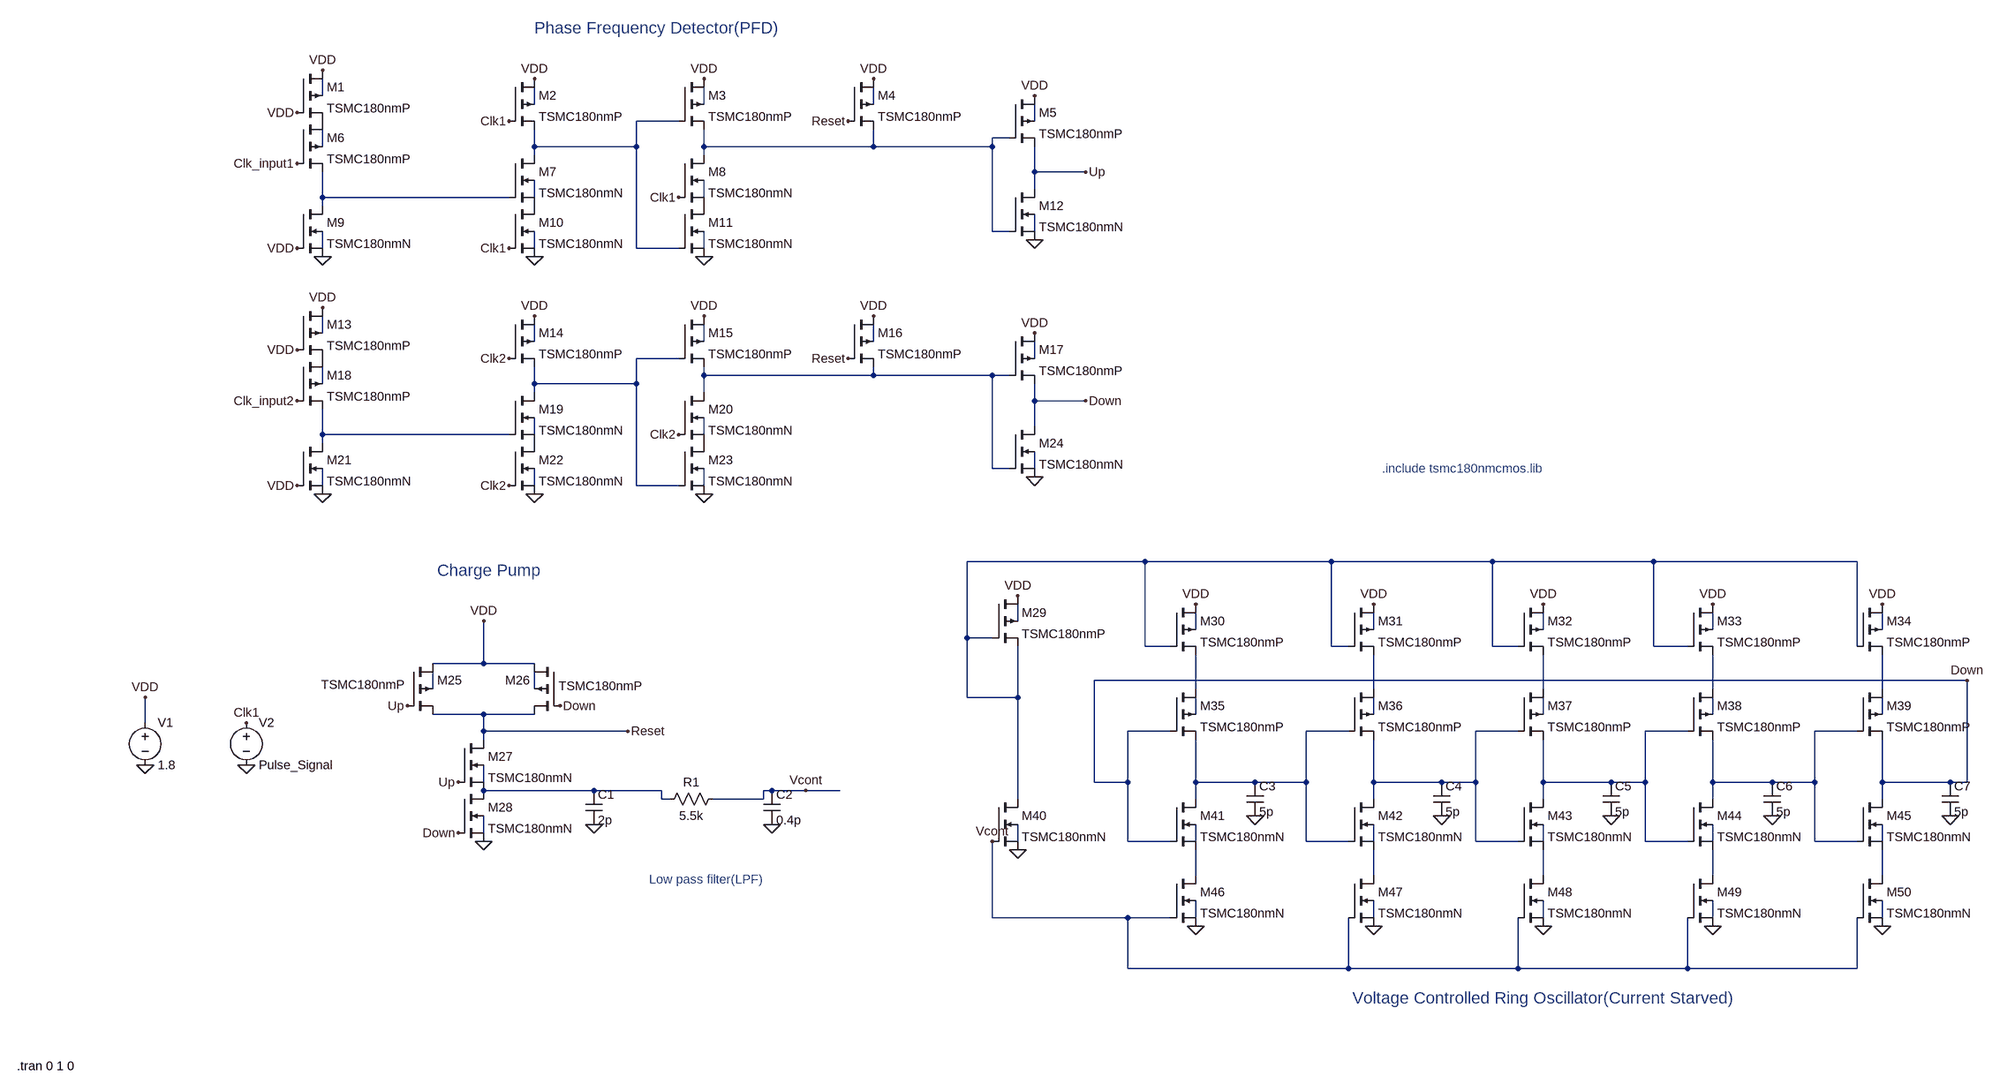
[diagram p0: schematic Pll.asc]
Pll.asc, the LTspice schematic file:
Version 4
SHEET 1 5760 2408
WIRE 1120 -464 1120 -496
WIRE 1520 -448 1520 -480
WIRE 1840 -448 1840 -480
WIRE 2160 -448 2160 -480
WIRE 1792 -416 1712 -416
WIRE 2464 -416 2464 -448
WIRE 2416 -384 2384 -384
WIRE 1120 -368 1120 -400
WIRE 1520 -368 1520 -400
WIRE 1712 -368 1712 -416
WIRE 1712 -368 1520 -368
WIRE 1840 -368 1840 -400
WIRE 2160 -368 2160 -400
WIRE 2160 -368 1840 -368
WIRE 2384 -368 2384 -384
WIRE 2384 -368 2160 -368
WIRE 1520 -352 1520 -368
WIRE 1840 -352 1840 -368
WIRE 2464 -320 2464 -368
WIRE 2560 -320 2464 -320
WIRE 2464 -288 2464 -320
WIRE 1120 -272 1120 -320
WIRE 1472 -272 1120 -272
WIRE 1520 -272 1520 -304
WIRE 1840 -272 1840 -304
WIRE 1120 -256 1120 -272
WIRE 2384 -208 2384 -368
WIRE 2416 -208 2384 -208
WIRE 2464 -208 2464 -240
WIRE 1120 -176 1120 -208
WIRE 1520 -176 1520 -208
WIRE 1712 -176 1712 -368
WIRE 1792 -176 1712 -176
WIRE 1840 -176 1840 -208
WIRE 1120 -16 1120 -48
WIRE 1520 0 1520 -32
WIRE 1840 0 1840 -32
WIRE 2160 0 2160 -32
WIRE 1792 32 1712 32
WIRE 2464 32 2464 0
WIRE 1840 64 1840 48
WIRE 2160 64 2160 48
WIRE 2160 64 1840 64
WIRE 2384 64 2160 64
WIRE 2416 64 2384 64
WIRE 1120 80 1120 48
WIRE 1520 80 1520 48
WIRE 1712 80 1712 32
WIRE 1712 80 1520 80
WIRE 1520 96 1520 80
WIRE 1840 96 1840 64
WIRE 2464 112 2464 80
WIRE 2560 112 2464 112
WIRE 2464 160 2464 112
WIRE 1120 176 1120 128
WIRE 1472 176 1120 176
WIRE 1520 176 1520 144
WIRE 1840 176 1840 144
WIRE 1120 192 1120 176
WIRE 2384 240 2384 64
WIRE 2416 240 2384 240
WIRE 2464 240 2464 208
WIRE 1120 272 1120 240
WIRE 1520 272 1520 240
WIRE 1712 272 1712 80
WIRE 1792 272 1712 272
WIRE 1840 272 1840 240
WIRE 2672 496 2336 496
WIRE 3024 496 2672 496
WIRE 3328 496 3024 496
WIRE 3632 496 3328 496
WIRE 4016 496 3632 496
WIRE 2432 608 2432 576
WIRE 2768 624 2768 592
WIRE 3104 624 3104 592
WIRE 3424 624 3424 592
WIRE 3744 624 3744 592
WIRE 4064 624 4064 592
WIRE 2336 640 2336 496
WIRE 2384 640 2336 640
WIRE 2672 656 2672 496
WIRE 2720 656 2672 656
WIRE 3024 656 3024 496
WIRE 3056 656 3024 656
WIRE 3328 656 3328 496
WIRE 3376 656 3328 656
WIRE 3632 656 3632 496
WIRE 3696 656 3632 656
WIRE 4016 656 4016 496
WIRE 1424 688 1424 608
WIRE 1424 688 1328 688
WIRE 1520 688 1424 688
WIRE 4224 720 2576 720
WIRE 1328 736 1328 704
WIRE 1520 736 1520 704
WIRE 2768 736 2768 672
WIRE 3104 736 3104 672
WIRE 3424 736 3424 672
WIRE 3744 736 3744 672
WIRE 4064 736 4064 672
WIRE 2336 752 2336 640
WIRE 2432 752 2432 656
WIRE 2432 752 2336 752
WIRE 1424 784 1328 784
WIRE 1520 784 1424 784
WIRE 2768 784 2768 752
WIRE 3104 784 3104 752
WIRE 3424 784 3424 752
WIRE 3744 784 3744 752
WIRE 4064 784 4064 752
WIRE 640 800 640 752
WIRE 1424 816 1424 784
WIRE 1696 816 1424 816
WIRE 2720 816 2640 816
WIRE 3056 816 2976 816
WIRE 3376 816 3296 816
WIRE 3696 816 3616 816
WIRE 4016 816 3936 816
WIRE 1424 832 1424 816
WIRE 1424 912 1424 880
WIRE 2576 912 2576 720
WIRE 2640 912 2640 816
WIRE 2640 912 2576 912
WIRE 2768 912 2768 832
WIRE 2880 912 2768 912
WIRE 2976 912 2976 816
WIRE 2976 912 2880 912
WIRE 3104 912 3104 832
WIRE 3232 912 3104 912
WIRE 3296 912 3296 816
WIRE 3296 912 3232 912
WIRE 3424 912 3424 832
WIRE 3552 912 3424 912
WIRE 3616 912 3616 816
WIRE 3616 912 3552 912
WIRE 3744 912 3744 832
WIRE 3856 912 3744 912
WIRE 3936 912 3936 816
WIRE 3936 912 3856 912
WIRE 4064 912 4064 832
WIRE 4192 912 4064 912
WIRE 4224 912 4224 720
WIRE 4224 912 4192 912
WIRE 1632 928 1424 928
WIRE 1760 928 1632 928
WIRE 1968 928 1952 928
WIRE 2032 928 1968 928
WIRE 2096 928 2032 928
WIRE 1760 944 1760 928
WIRE 1776 944 1760 944
WIRE 1952 944 1952 928
WIRE 1952 944 1856 944
WIRE 2432 944 2432 752
WIRE 2768 944 2768 912
WIRE 3104 944 3104 912
WIRE 3424 944 3424 912
WIRE 3744 944 3744 912
WIRE 4064 944 4064 912
WIRE 1424 1008 1424 976
WIRE 2432 1024 2432 992
WIRE 2640 1024 2640 912
WIRE 2720 1024 2640 1024
WIRE 2768 1024 2768 992
WIRE 2976 1024 2976 912
WIRE 3056 1024 2976 1024
WIRE 3104 1024 3104 992
WIRE 3296 1024 3296 912
WIRE 3376 1024 3296 1024
WIRE 3424 1024 3424 992
WIRE 3616 1024 3616 912
WIRE 3696 1024 3616 1024
WIRE 3744 1024 3744 992
WIRE 3936 1024 3936 912
WIRE 4016 1024 3936 1024
WIRE 4064 1024 4064 992
WIRE 2768 1088 2768 1040
WIRE 3104 1088 3104 1040
WIRE 3424 1088 3424 1040
WIRE 3744 1088 3744 1040
WIRE 4064 1088 4064 1040
WIRE 2384 1168 2384 1024
WIRE 2640 1168 2384 1168
WIRE 2720 1168 2640 1168
WIRE 2768 1168 2768 1136
WIRE 3104 1168 3104 1136
WIRE 3424 1168 3424 1136
WIRE 3744 1168 3744 1136
WIRE 4064 1168 4064 1136
WIRE 2640 1264 2640 1168
WIRE 3056 1264 3056 1168
WIRE 3056 1264 2640 1264
WIRE 3376 1264 3376 1168
WIRE 3376 1264 3056 1264
WIRE 3696 1264 3696 1168
WIRE 3696 1264 3376 1264
WIRE 4016 1264 4016 1168
WIRE 4016 1264 3696 1264
FLAG 640 752 VDD
FLAG 640 880 0
FLAG 976 800 Clk1
FLAG 976 880 0
FLAG 3104 1184 0
FLAG 3424 1184 0
FLAG 3744 1184 0
FLAG 4064 1184 0
FLAG 2768 576 VDD
FLAG 3104 576 VDD
FLAG 3424 576 VDD
FLAG 3744 576 VDD
FLAG 4064 576 VDD
FLAG 2432 1040 0
FLAG 2768 1184 0
FLAG 2432 560 VDD
FLAG 4224 720 Down
FLAG 1120 -160 0
FLAG 1520 -160 0
FLAG 1120 -512 VDD
FLAG 1520 -496 VDD
FLAG 1840 -160 0
FLAG 1840 -496 VDD
FLAG 2160 -496 VDD
FLAG 2464 -464 VDD
FLAG 2464 -192 0
FLAG 1120 288 0
FLAG 1520 288 0
FLAG 1120 -64 VDD
FLAG 1520 -48 VDD
FLAG 1840 288 0
FLAG 1840 -48 VDD
FLAG 2160 -48 VDD
FLAG 2464 -16 VDD
FLAG 2464 256 0
FLAG 1072 -432 VDD
FLAG 1072 -176 VDD
FLAG 1072 -336 Clk_input1
FLAG 1072 16 VDD
FLAG 1072 272 VDD
FLAG 1472 -416 Clk1
FLAG 1472 -176 Clk1
FLAG 1792 -272 Clk1
FLAG 1072 112 Clk_input2
FLAG 1472 32 Clk2
FLAG 1472 272 Clk2
FLAG 1792 176 Clk2
FLAG 1424 1024 0
FLAG 1424 608 VDD
FLAG 2560 -320 Up
FLAG 2560 112 Down
FLAG 1280 768 Up
FLAG 1376 912 Up
FLAG 1376 1008 Down
FLAG 1568 768 Down
FLAG 1696 816 Reset
FLAG 2112 -416 Reset
FLAG 2112 32 Reset
FLAG 2880 976 0
FLAG 3232 976 0
FLAG 3552 976 0
FLAG 3856 976 0
FLAG 4192 976 0
FLAG 2384 1024 Vcont
FLAG 1632 992 0
FLAG 1968 992 0
FLAG 2032 928 Vcont
SYMBOL voltage 640 784 R0
WINDOW 123 0 0 Left 0
WINDOW 39 0 0 Left 0
SYMATTR InstName V1
SYMATTR Value 1.8
SYMBOL voltage 976 784 R0
WINDOW 123 0 0 Left 0
WINDOW 39 0 0 Left 0
SYMATTR InstName V2
SYMATTR Value Pulse_Signal
SYMBOL pmos4 2720 736 R0
SYMATTR InstName M35
SYMATTR Value TSMC180nmP
SYMBOL nmos4 2720 944 R0
SYMATTR InstName M41
SYMATTR Value TSMC180nmN
SYMBOL pmos4 3056 736 R0
SYMATTR InstName M36
SYMATTR Value TSMC180nmP
SYMBOL nmos4 3056 944 R0
SYMATTR InstName M42
SYMATTR Value TSMC180nmN
SYMBOL pmos4 3376 736 R0
SYMATTR InstName M37
SYMATTR Value TSMC180nmP
SYMBOL nmos4 3376 944 R0
SYMATTR InstName M43
SYMATTR Value TSMC180nmN
SYMBOL pmos4 3696 736 R0
SYMATTR InstName M38
SYMATTR Value TSMC180nmP
SYMBOL nmos4 3696 944 R0
SYMATTR InstName M44
SYMATTR Value TSMC180nmN
SYMBOL pmos4 4016 736 R0
SYMATTR InstName M39
SYMATTR Value TSMC180nmP
SYMBOL nmos4 4016 944 R0
SYMATTR InstName M45
SYMATTR Value TSMC180nmN
SYMBOL pmos4 2720 576 R0
SYMATTR InstName M30
SYMATTR Value TSMC180nmP
SYMBOL pmos4 3056 576 R0
SYMATTR InstName M31
SYMATTR Value TSMC180nmP
SYMBOL pmos4 3376 576 R0
SYMATTR InstName M32
SYMATTR Value TSMC180nmP
SYMBOL pmos4 3696 576 R0
SYMATTR InstName M33
SYMATTR Value TSMC180nmP
SYMBOL pmos4 4016 576 R0
SYMATTR InstName M34
SYMATTR Value TSMC180nmP
SYMBOL nmos4 3056 1088 R0
SYMATTR InstName M47
SYMATTR Value TSMC180nmN
SYMBOL nmos4 3376 1088 R0
SYMATTR InstName M48
SYMATTR Value TSMC180nmN
SYMBOL nmos4 3696 1088 R0
SYMATTR InstName M49
SYMATTR Value TSMC180nmN
SYMBOL nmos4 4016 1088 R0
SYMATTR InstName M50
SYMATTR Value TSMC180nmN
SYMBOL pmos4 2384 560 R0
SYMATTR InstName M29
SYMATTR Value TSMC180nmP
SYMBOL nmos4 2384 944 R0
SYMATTR InstName M40
SYMATTR Value TSMC180nmN
SYMBOL nmos4 2720 1088 R0
SYMATTR InstName M46
SYMATTR Value TSMC180nmN
SYMBOL pmos4 1072 -512 R0
SYMATTR InstName M1
SYMATTR Value TSMC180nmP
SYMBOL pmos4 1072 -416 R0
SYMATTR InstName M6
SYMATTR Value TSMC180nmP
SYMATTR Value2 l=180n w=240n
SYMBOL nmos4 1072 -256 R0
SYMATTR InstName M9
SYMATTR Value TSMC180nmN
SYMBOL nmos4 1472 -256 R0
SYMATTR InstName M10
SYMATTR Value TSMC180nmN
SYMBOL nmos4 1472 -352 R0
SYMATTR InstName M7
SYMATTR Value TSMC180nmN
SYMBOL pmos4 1472 -496 R0
SYMATTR InstName M2
SYMATTR Value TSMC180nmP
SYMBOL nmos4 1792 -256 R0
SYMATTR InstName M11
SYMATTR Value TSMC180nmN
SYMBOL nmos4 1792 -352 R0
SYMATTR InstName M8
SYMATTR Value TSMC180nmN
SYMATTR Value2 l=180n w=600n
SYMBOL pmos4 1792 -496 R0
SYMATTR InstName M3
SYMATTR Value TSMC180nmP
SYMBOL pmos4 2112 -496 R0
SYMATTR InstName M4
SYMATTR Value TSMC180nmP
SYMBOL pmos4 2416 -464 R0
SYMATTR InstName M5
SYMATTR Value TSMC180nmP
SYMBOL nmos4 2416 -288 R0
SYMATTR InstName M12
SYMATTR Value TSMC180nmN
SYMBOL pmos4 1072 -64 R0
SYMATTR InstName M13
SYMATTR Value TSMC180nmP
SYMBOL pmos4 1072 32 R0
SYMATTR InstName M18
SYMATTR Value TSMC180nmP
SYMBOL nmos4 1072 192 R0
SYMATTR InstName M21
SYMATTR Value TSMC180nmN
SYMBOL nmos4 1472 192 R0
SYMATTR InstName M22
SYMATTR Value TSMC180nmN
SYMBOL nmos4 1472 96 R0
SYMATTR InstName M19
SYMATTR Value TSMC180nmN
SYMBOL pmos4 1472 -48 R0
SYMATTR InstName M14
SYMATTR Value TSMC180nmP
SYMBOL nmos4 1792 192 R0
SYMATTR InstName M23
SYMATTR Value TSMC180nmN
SYMBOL nmos4 1792 96 R0
SYMATTR InstName M20
SYMATTR Value TSMC180nmN
SYMBOL pmos4 1792 -48 R0
SYMATTR InstName M15
SYMATTR Value TSMC180nmP
SYMBOL pmos4 2112 -48 R0
SYMATTR InstName M16
SYMATTR Value TSMC180nmP
SYMBOL pmos4 2416 -16 R0
SYMATTR InstName M17
SYMATTR Value TSMC180nmP
SYMBOL nmos4 2416 160 R0
SYMATTR InstName M24
SYMATTR Value TSMC180nmN
SYMBOL pmos4 1280 688 R0
WINDOW 3 -163 40 Left 2
SYMATTR Value TSMC180nmP
SYMATTR InstName M25
SYMBOL pmos4 1568 688 M0
WINDOW 3 -156 43 Left 2
SYMATTR Value TSMC180nmP
SYMATTR InstName M26
SYMBOL nmos4 1376 832 R0
SYMATTR InstName M27
SYMATTR Value TSMC180nmN
SYMBOL nmos4 1376 928 R0
SYMATTR InstName M28
SYMATTR Value TSMC180nmN
SYMBOL cap 2864 912 R0
SYMATTR InstName C3
SYMATTR Value 5p
SYMBOL cap 3216 912 R0
SYMATTR InstName C4
SYMATTR Value 5p
SYMBOL cap 3536 912 R0
SYMATTR InstName C5
SYMATTR Value 5p
SYMBOL cap 3840 912 R0
SYMATTR InstName C6
SYMATTR Value 5p
SYMBOL cap 4176 912 R0
SYMATTR InstName C7
SYMATTR Value 5p
SYMBOL cap 1616 928 R0
SYMATTR InstName C1
SYMATTR Value 2p
SYMBOL cap 1952 928 R0
SYMATTR InstName C2
SYMATTR Value 0.4p
SYMBOL res 1872 928 R90
WINDOW 0 0 56 VBottom 2
WINDOW 3 32 56 VTop 2
SYMATTR InstName R1
SYMATTR Value 5.5k
TEXT -1072 1448 Left 2 !.tran 0 1 0
TEXT 3064 1320 Left 3 ;Voltage Controlled Ring Oscillator(Current Starved)
TEXT 1520 -592 Left 3 ;Phase Frequency Detector(PFD)
TEXT 1336 512 Left 3 ;Charge Pump
TEXT 1736 1096 Left 2 ;Low pass filter(LPF)
TEXT 3120 240 Left 2 ;.include tsmc180nmcmos.lib

The netlist it stands for:
* Pll.asc
V1 VDD 0 1.8
V2 Clk1 0 Pulse_Signal
M35 N040 Down N050 N045 TSMC180nmP
M41 N050 Down N063 N058 TSMC180nmN
M36 N041 N050 N051 N046 TSMC180nmP
M42 N051 N050 N064 N059 TSMC180nmN
M37 N042 N051 N052 N047 TSMC180nmP
M43 N052 N051 N065 N060 TSMC180nmN
M38 N043 N052 N053 N048 TSMC180nmP
M44 N053 N052 N066 N061 TSMC180nmN
M39 N044 N053 Down N049 TSMC180nmP
M45 Down N053 N067 N062 TSMC180nmN
M30 VDD N031 N040 N033 TSMC180nmP
M31 VDD N031 N041 N034 TSMC180nmP
M32 VDD N031 N042 N035 TSMC180nmP
M33 VDD N031 N043 N036 TSMC180nmP
M34 VDD N031 N044 N037 TSMC180nmP
M47 N064 Vcont 0 N069 TSMC180nmN
M48 N065 Vcont 0 N070 TSMC180nmN
M49 N066 Vcont 0 N071 TSMC180nmN
M50 N067 Vcont 0 N072 TSMC180nmN
M29 VDD N031 N031 N032 TSMC180nmP
M40 N031 Vcont 0 N057 TSMC180nmN
M46 N063 Vcont 0 N068 TSMC180nmN
M1 VDD VDD P001 N001 TSMC180nmP
M6 P001 Clk_input1 N009 N008 TSMC180nmP l=180n w=240n
M9 N009 VDD 0 N013 TSMC180nmN
M10 P002 Clk1 0 N014 TSMC180nmN
M7 N005 N009 P002 N010 TSMC180nmN
M2 VDD Clk1 N005 N002 TSMC180nmP
M11 P003 N005 0 N015 TSMC180nmN
M8 N007 Clk1 P003 N011 TSMC180nmN l=180n w=600n
M3 VDD N005 N007 N003 TSMC180nmP
M4 VDD Reset N007 N004 TSMC180nmP
M5 VDD N007 Up N006 TSMC180nmP
M12 Up N007 0 N012 TSMC180nmN
M13 VDD VDD P004 N016 TSMC180nmP
M18 P004 Clk_input2 N024 N023 TSMC180nmP
M21 N024 VDD 0 N028 TSMC180nmN
M22 P005 Clk2 0 N029 TSMC180nmN
M19 N020 N024 P005 N025 TSMC180nmN
M14 VDD Clk2 N020 N017 TSMC180nmP
M23 P006 N020 0 N030 TSMC180nmN
M20 N022 Clk2 P006 N026 TSMC180nmN
M15 VDD N020 N022 N018 TSMC180nmP
M16 VDD Reset N022 N019 TSMC180nmP
M17 VDD N022 Down N021 TSMC180nmP
M24 Down N022 0 N027 TSMC180nmN
M25 VDD Up Reset N038 TSMC180nmP
M26 VDD Down Reset N039 TSMC180nmP
M27 Reset Up N055 N054 TSMC180nmN
M28 N055 Down 0 N056 TSMC180nmN
C3 N050 0 5p
C4 N051 0 5p
C5 N052 0 5p
C6 N053 0 5p
C7 Down 0 5p
C1 N055 0 2p
C2 Vcont 0 0.4p
R1 Vcont N055 5.5k
.model NMOS NMOS
.model PMOS PMOS
.lib standard.mos
.tran 0 1 0
* Voltage Controlled Ring Oscillator(Current Starved)
* Phase Frequency Detector(PFD)
* Charge Pump
* Low pass filter(LPF)
* .include tsmc180nmcmos.lib
.backanno
.end